# Altium schematic sheet Controller.SchDoc
size A3
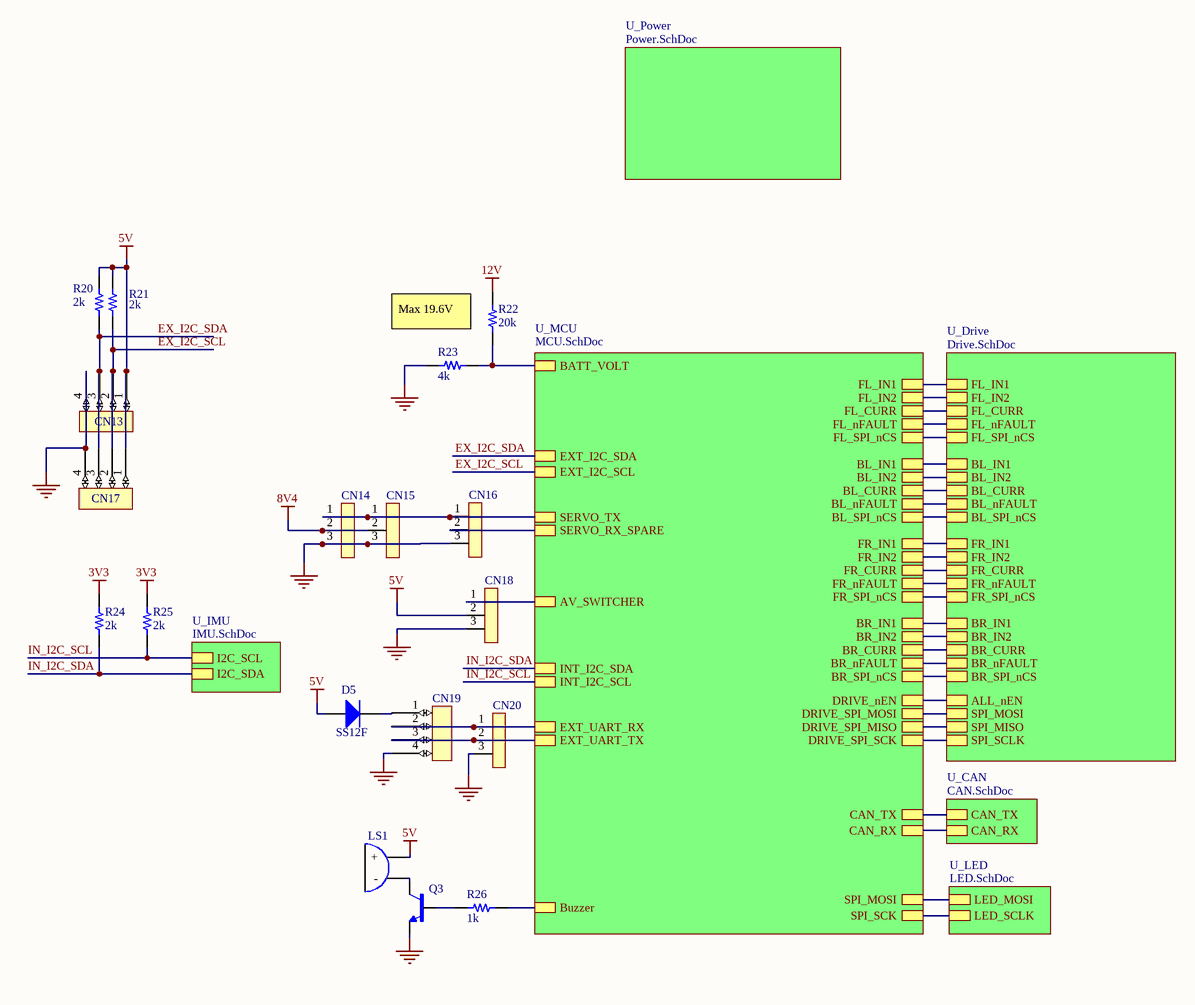
[diagram p0: Controller.SchDoc]

## Parts
CN13  JST_GH-4P  [JST_GH-4P]  (value not drawn)
CN14  3P-2.5mm  [2.5mm-3P]  (value not drawn)
CN15  3P-2.5mm  [2.5mm-3P]  (value not drawn)
CN16  3P-2.5mm  [2.5mm-3P]  (value not drawn)
CN17  JST_GH-4P  [JST_GH-4P]  (value not drawn)
CN18  3P-2.5mm  [2.5mm-3P]  (value not drawn)
CN19  JST_GH-4P  [JST_GH-4P]  (value not drawn)
CN20  3P-2.5mm  [2.5mm-3P]  (value not drawn)
D5  SS12F  [SMAF_DIODE]
LS1  Buzzer  [12-dia-buzzer]  (value not drawn)
Q3  S8050  [SOT23-FET]  (value not drawn)
R20  2k  [2010_SMD_Resistor]
R21  2k  [2010_SMD_Resistor]
R22  20k  [0805 - duplicate]
R23  4k  [0805 - duplicate]
R24  2k  [0805 - duplicate]
R25  2k  [0805 - duplicate]
R26  1k  [0805 - duplicate]

## Sub-sheets
U_CAN = CAN.SchDoc: CAN_TX, CAN_RX
U_Drive = Drive.SchDoc: FL_IN1, FL_IN2, ALL_nEN, BL_IN1, BL_IN2, FR_IN1, FR_IN2, BR_IN1, BR_IN2, FL_nFAULT, BL_nFAULT, BR_nFAULT, FR_nFAULT, FL_SPI_nCS, BL_SPI_nCS, BR_SPI_nCS, FR_SPI_nCS, SPI_MOSI, SPI_MISO, SPI_SCLK, BL_CURR, BR_CURR, FL_CURR, FR_CURR
U_IMU = IMU.SchDoc: I2C_SCL, I2C_SDA
U_LED = LED.SchDoc: LED_MOSI, LED_SCLK
U_MCU = MCU.SchDoc: BR_SPI_nCS, FR_SPI_nCS, BL_SPI_nCS, FL_SPI_nCS, FL_nFAULT, BL_nFAULT, FR_nFAULT, BR_nFAULT, BL_IN2, DRIVE_nEN, DRIVE_SPI_SCK, DRIVE_SPI_MISO, FR_IN2, SERVO_TX, SERVO_RX_SPARE, BL_CURR, FL_CURR, BATT_VOLT, BR_CURR, FR_CURR, FL_IN1, FL_IN2, BL_IN1, SPI_MOSI, SPI_SCK, FR_IN1, BR_IN1, BR_IN2, EXT_I2C_SCL, EXT_I2C_SDA, CAN_TX, CAN_RX, INT_I2C_SDA, INT_I2C_SCL, DRIVE_SPI_MOSI, EXT_UART_RX, EXT_UART_TX, AV_SWITCHER, Buzzer
U_Power = Power.SchDoc: no entries

## Nets
3V3: R24.2 R25.2
5V: CN13.1 CN17.1 CN18.2 D5.1(A) LS1.A(+) R20.2 R21.2
8V4: CN14.2 CN15.2
12V: R22.2
GND: CN13.4 CN14.3 CN15.3 CN16.3 CN17.4 CN18.3 CN19.4 CN20.3 Q3.2(E) R23.2
EX_I2C_SCL: CN13.2 CN17.2 R21.1 ; sheet U_MCU/EXT_I2C_SCL
EX_I2C_SDA: CN13.3 CN17.3 R20.1 ; sheet U_MCU/EXT_I2C_SDA
IN_I2C_SCL: R25.1 ; sheet U_IMU/I2C_SCL, sheet U_MCU/INT_I2C_SCL
IN_I2C_SDA: R24.1 ; sheet U_IMU/I2C_SDA, sheet U_MCU/INT_I2C_SDA
NetCN14_1: CN14.1 CN15.1 CN16.1 ; sheet U_MCU/SERVO_TX
NetCN16_2: CN16.2 ; sheet U_MCU/SERVO_RX_SPARE
NetCN18_1: CN18.1 ; sheet U_MCU/AV_SWITCHER
NetCN19_1: CN19.1 D5.2(K)
NetCN19_2: CN19.2 CN20.1 ; sheet U_MCU/EXT_UART_RX
NetCN19_3: CN19.3 CN20.2 ; sheet U_MCU/EXT_UART_TX
NetLS1_K: LS1.K(-) Q3.3(C)
NetQ3_1: Q3.1(B) R26.1
NetR22_1: R22.1 R23.1 ; sheet U_MCU/BATT_VOLT
NetR26_2: R26.2 ; sheet U_MCU/Buzzer
(unnamed): sheet U_MCU/BR_SPI_nCS, sheet U_Drive/BR_SPI_nCS
(unnamed): sheet U_MCU/FR_SPI_nCS, sheet U_Drive/FR_SPI_nCS
(unnamed): sheet U_MCU/BL_SPI_nCS, sheet U_Drive/BL_SPI_nCS
(unnamed): sheet U_MCU/FL_SPI_nCS, sheet U_Drive/FL_SPI_nCS
(unnamed): sheet U_MCU/FL_nFAULT, sheet U_Drive/FL_nFAULT
(unnamed): sheet U_MCU/BL_nFAULT, sheet U_Drive/BL_nFAULT
(unnamed): sheet U_MCU/FR_nFAULT, sheet U_Drive/FR_nFAULT
(unnamed): sheet U_MCU/BR_nFAULT, sheet U_Drive/BR_nFAULT
(unnamed): sheet U_MCU/BL_IN2, sheet U_Drive/BL_IN2
(unnamed): sheet U_MCU/DRIVE_nEN, sheet U_Drive/ALL_nEN
(unnamed): sheet U_MCU/DRIVE_SPI_SCK, sheet U_Drive/SPI_SCLK
(unnamed): sheet U_MCU/DRIVE_SPI_MISO, sheet U_Drive/SPI_MISO
(unnamed): sheet U_MCU/FR_IN2, sheet U_Drive/FR_IN2
(unnamed): sheet U_MCU/BL_CURR, sheet U_Drive/BL_CURR
(unnamed): sheet U_MCU/FL_CURR, sheet U_Drive/FL_CURR
(unnamed): sheet U_MCU/BR_CURR, sheet U_Drive/BR_CURR
(unnamed): sheet U_MCU/FR_CURR, sheet U_Drive/FR_CURR
(unnamed): sheet U_MCU/FL_IN1, sheet U_Drive/FL_IN1
(unnamed): sheet U_MCU/FL_IN2, sheet U_Drive/FL_IN2
(unnamed): sheet U_MCU/BL_IN1, sheet U_Drive/BL_IN1
(unnamed): sheet U_MCU/SPI_MOSI, sheet U_LED/LED_MOSI
(unnamed): sheet U_MCU/SPI_SCK, sheet U_LED/LED_SCLK
(unnamed): sheet U_MCU/FR_IN1, sheet U_Drive/FR_IN1
(unnamed): sheet U_MCU/BR_IN1, sheet U_Drive/BR_IN1
(unnamed): sheet U_MCU/BR_IN2, sheet U_Drive/BR_IN2
(unnamed): sheet U_MCU/CAN_TX, sheet U_CAN/CAN_TX
(unnamed): sheet U_MCU/CAN_RX, sheet U_CAN/CAN_RX
(unnamed): sheet U_MCU/DRIVE_SPI_MOSI, sheet U_Drive/SPI_MOSI

## Notes on the sheet
- (near R22) Max 19.6V

## Library data of the parts
Q3 = S8050: MF: MICROSS/On Semiconductor; MP: 2N2222; Value: *; Package: TO-18-3 NJS; Digi-Key_Purchase_URL: https://www.digikey.com.mx/product-detail/en/microsemi-corporation/JANS2N2222A/1086-15156-ND/4384334?utm_source=snapeda&utm_medium=aggregator&utm_campaign=symbol; SnapEDA_Link: https://www.snapeda.com/parts/2N2222/MICROSS/On%20Semiconductor/view-part/561967/?ref=snap; Digi-Key_Part_Number: 1086-15156-ND
R20-R26 = Resistor